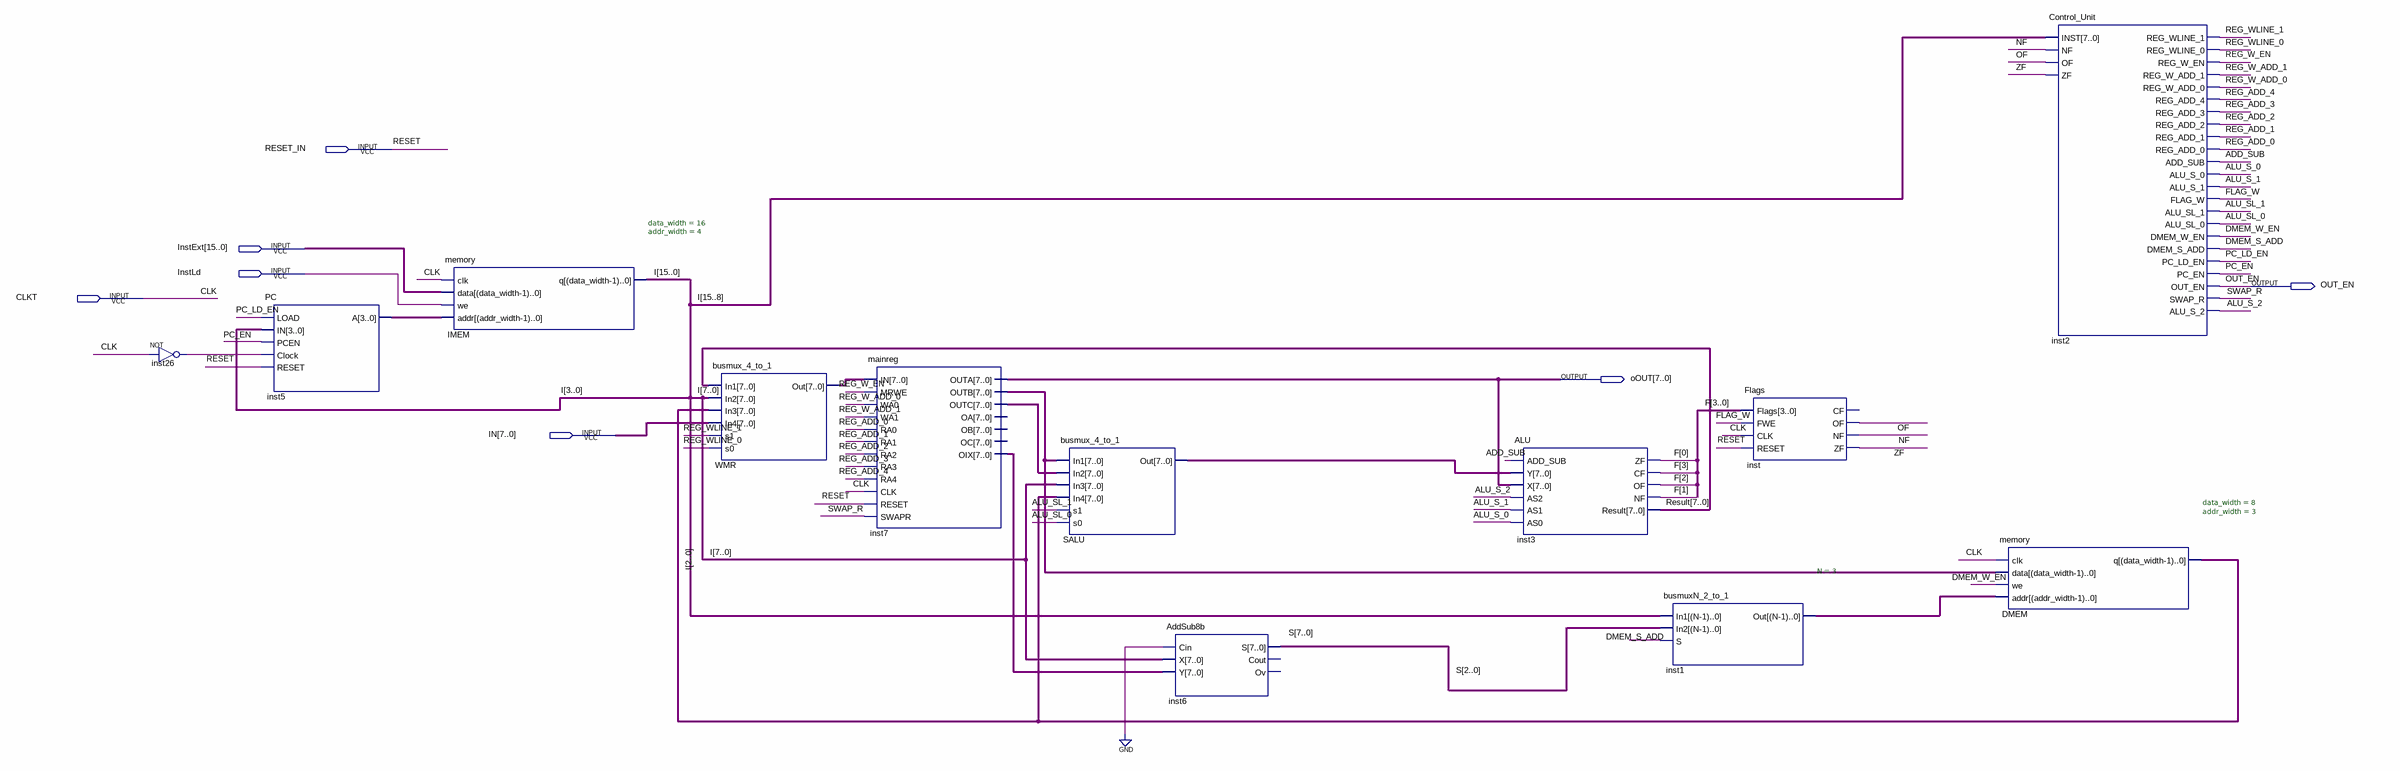
[diagram p0: schematic sheet]
// Quartus schematic CPU.bdf as structural Verilog: 12 symbols, 7 pins
module CPU (
  input  RESET_IN,
  input  [15:0] InstExt,
  input  InstLd,
  input  CLKT,
  input  [7:0] IN,
  output OUT_EN,
  output [7:0] oOUT
);

  wire ADD_SUB, ALU_S_0, ALU_S_1, ALU_S_2, ALU_SL_0, ALU_SL_1, DMEM_S_ADD, DMEM_W_EN, FLAG_W, inst26_out, NF,
       OF, PC_EN, PC_LD_EN, REG_ADD_0, REG_ADD_1, REG_ADD_2, REG_ADD_3, REG_ADD_4, REG_W_ADD_0, REG_W_ADD_1,
       REG_W_EN, REG_WLINE_0, REG_WLINE_1, SWAP_R, ZF;
  wire [2:0] inst1_out;
  wire [3:0] F, inst5_a;
  wire [7:0] DMEM_q, inst7_oix, inst7_outb, inst7_outc, Result, S, SALU_out, WMR_out;
  wire [15:0] I;

  not inst26 (inst26_out, CLKT);
  PC inst5 (.LOAD(PC_LD_EN), .IN(I[3:0]), .PCEN(PC_EN), .Clock(inst26_out), .RESET(RESET_IN), .A(inst5_a));
  memory #(.data_width(16), .addr_width(4)) IMEM (.clk(CLKT), .data(InstExt), .we(InstLd), .addr(inst5_a), .q(I));
  busmux_4_to_1 WMR (
    .In1(Result), .In2(I[7:0]), .In3(DMEM_q), .In4(IN), .s1(REG_WLINE_1), .s0(REG_WLINE_0), .Out(WMR_out));
  mainreg inst7 (
    .IN(WMR_out), .MRWE(REG_W_EN), .WA0(REG_W_ADD_0), .WA1(REG_W_ADD_1), .RA0(REG_ADD_0), .RA1(REG_ADD_1),
    .RA2(REG_ADD_2), .RA3(REG_ADD_3), .RA4(REG_ADD_4), .CLK(CLKT), .RESET(RESET_IN), .SWAPR(SWAP_R),
    .OUTA(oOUT), .OUTB(inst7_outb), .OUTC(inst7_outc), .OIX(inst7_oix));  // open: OA, OB, OC
  busmux_4_to_1 SALU (
    .In1(inst7_outb), .In2(inst7_outc), .In3(I[7:0]), .In4(DMEM_q), .s1(ALU_SL_1), .s0(ALU_SL_0),
    .Out(SALU_out));
  AddSub8b inst6 (.Cin(1'b0), .X(I[7:0]), .Y(inst7_oix), .S(S));  // open: Cout, Ov
  ALU inst3 (
    .ADD_SUB(ADD_SUB), .Y(SALU_out), .X(oOUT), .AS2(ALU_S_2), .AS1(ALU_S_1), .AS0(ALU_S_0), .ZF(F[0]),
    .CF(F[3]), .OF(F[2]), .NF(F[1]), .Result(Result));
  busmuxN_2_to_1 #(.N(3)) inst1 (.In1(I[2:0]), .In2(S[2:0]), .S(DMEM_S_ADD), .Out(inst1_out));
  Flags inst (.Flags(F), .FWE(FLAG_W), .CLK(CLKT), .RESET(RESET_IN), .OF(OF), .NF(NF), .ZF(ZF));  // open: CF
  memory #(.data_width(8), .addr_width(3)) DMEM (
    .clk(CLKT), .data(inst7_outb), .we(DMEM_W_EN), .addr(inst1_out), .q(DMEM_q));
  Control_Unit inst2 (
    .INST(I[15:8]), .NF(NF), .OF(OF), .ZF(ZF), .REG_WLINE_1(REG_WLINE_1), .REG_WLINE_0(REG_WLINE_0),
    .REG_W_EN(REG_W_EN), .REG_W_ADD_1(REG_W_ADD_1), .REG_W_ADD_0(REG_W_ADD_0), .REG_ADD_4(REG_ADD_4),
    .REG_ADD_3(REG_ADD_3), .REG_ADD_2(REG_ADD_2), .REG_ADD_1(REG_ADD_1), .REG_ADD_0(REG_ADD_0),
    .ADD_SUB(ADD_SUB), .ALU_S_0(ALU_S_0), .ALU_S_1(ALU_S_1), .FLAG_W(FLAG_W), .ALU_SL_1(ALU_SL_1),
    .ALU_SL_0(ALU_SL_0), .DMEM_W_EN(DMEM_W_EN), .DMEM_S_ADD(DMEM_S_ADD), .PC_LD_EN(PC_LD_EN), .PC_EN(PC_EN),
    .OUT_EN(OUT_EN), .SWAP_R(SWAP_R), .ALU_S_2(ALU_S_2));

  // Other names for the same wires on the sheet: CLK = CLKT; RESET = RESET_IN
endmodule
